# EasyEDA Pro project Violet_Usb_Hub.eprj

# Schematic Schematic1
Board Name: Board1; Create Date: 2026-05-30; Page Name: P1; Project Name: Violet_Usb_Hub; Schematic Name: Schematic1; Update Date: 2026-05-30; Company: EasyEDA.com; Page Size: A4; Version: V1.0
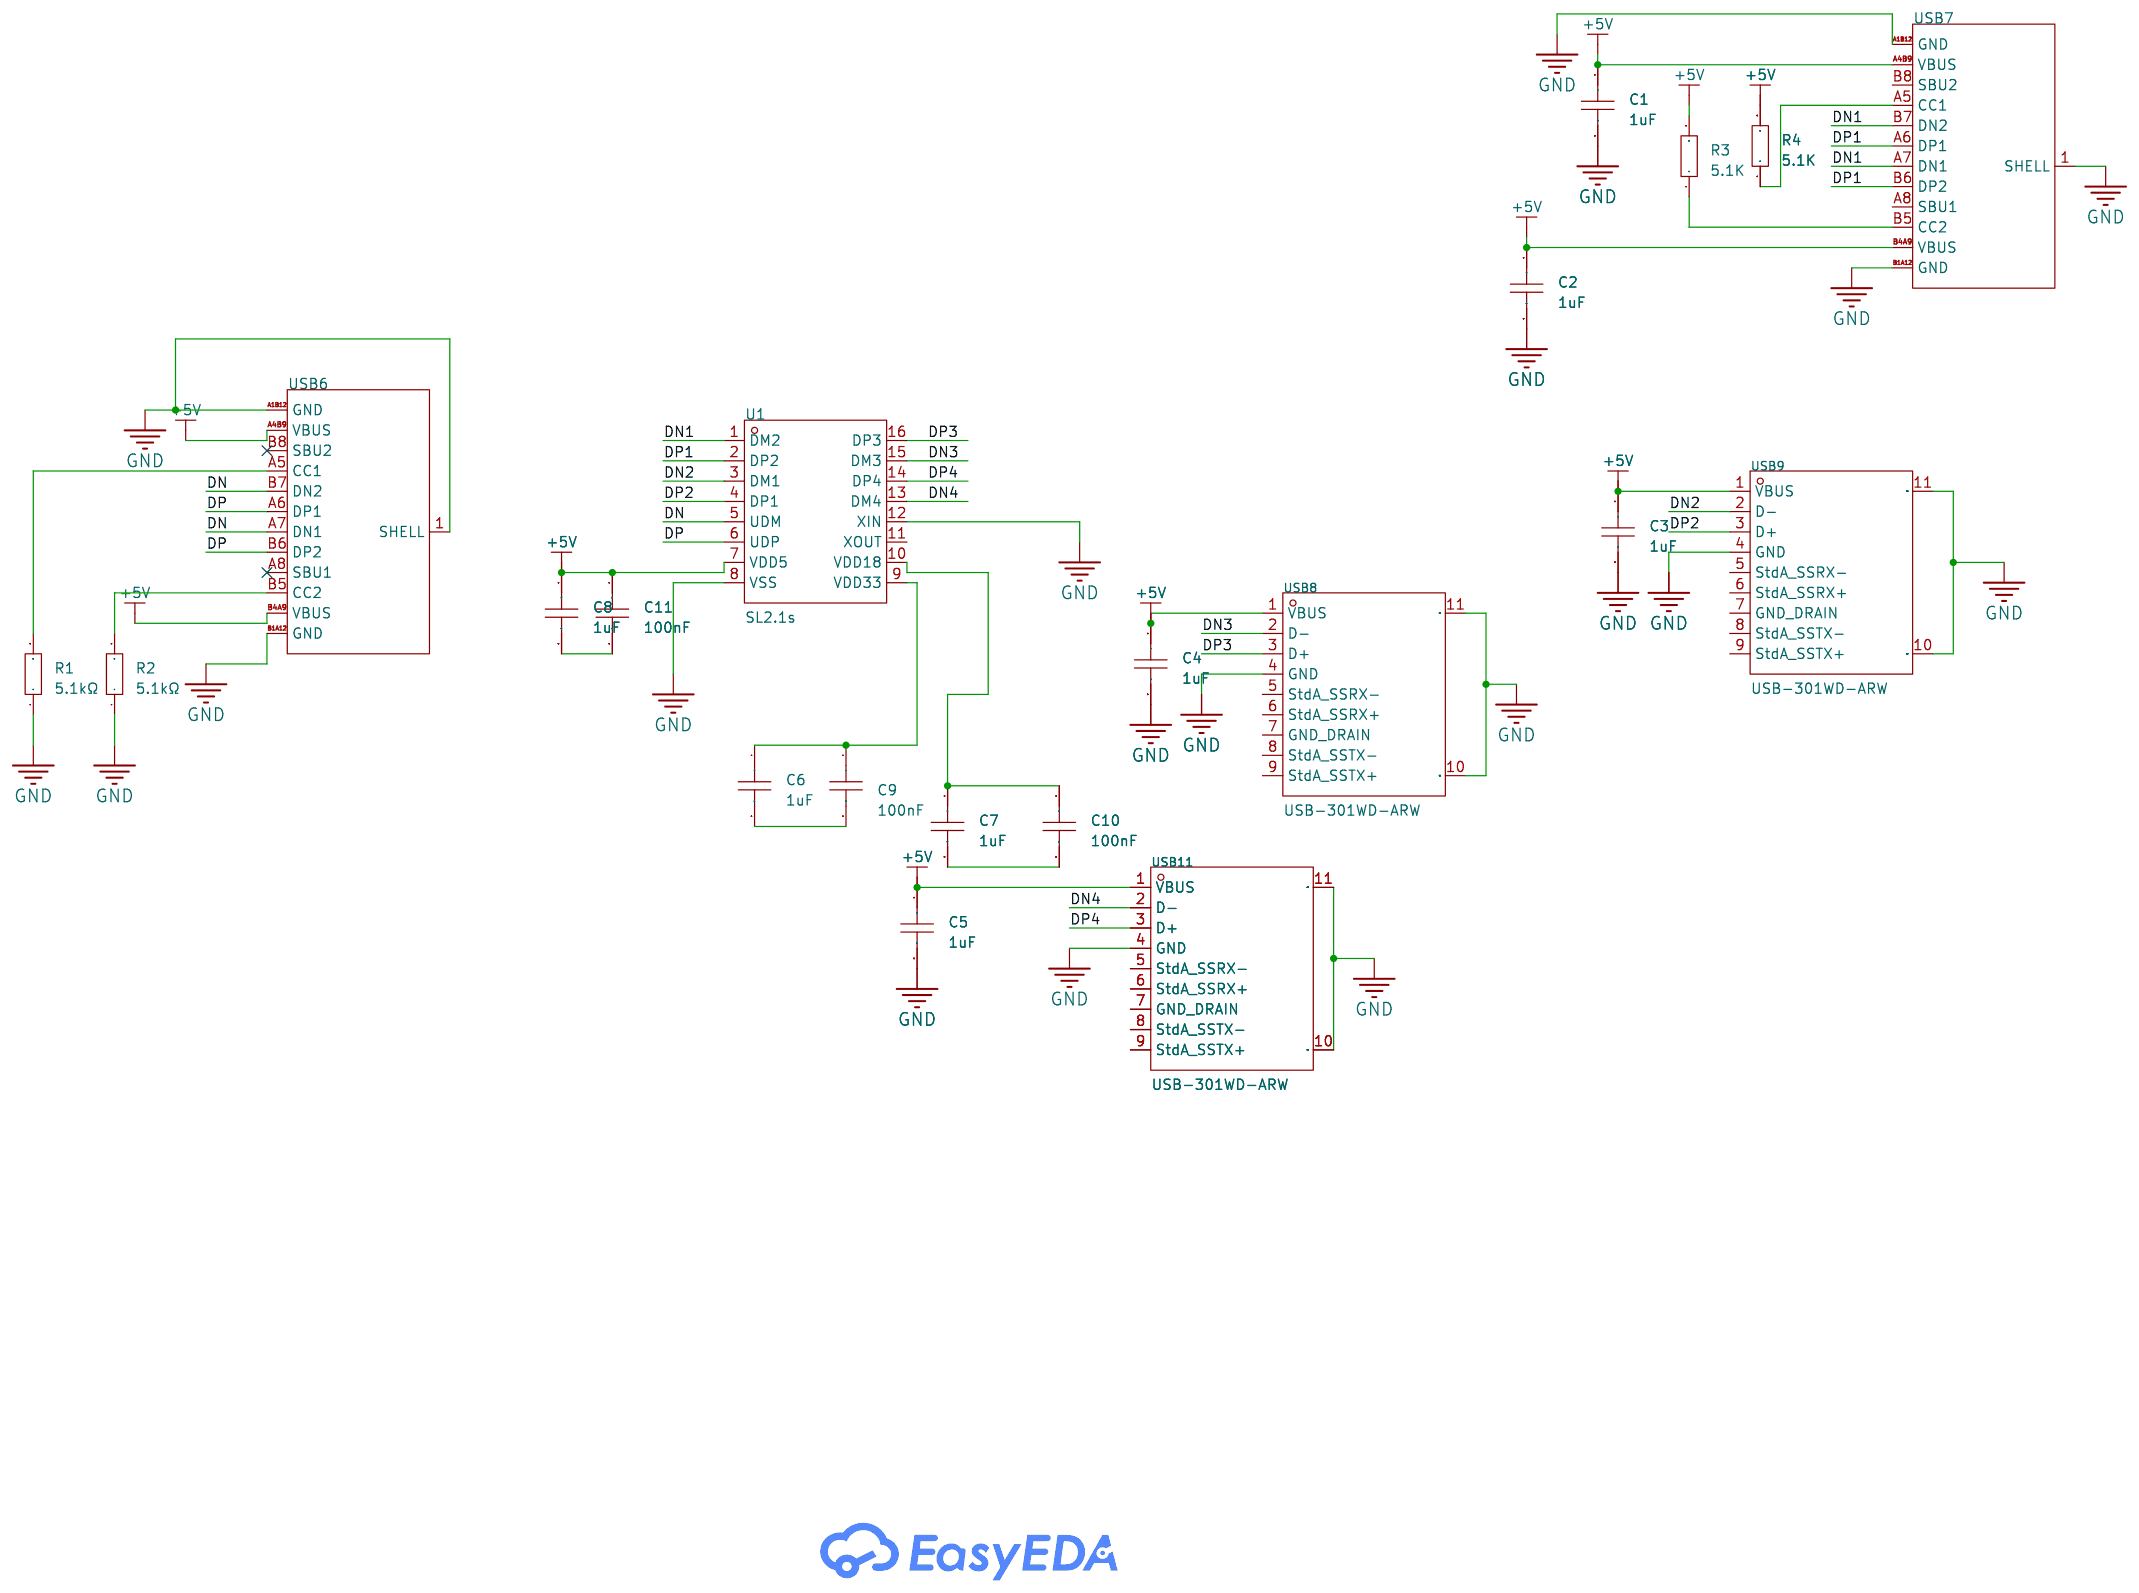
[diagram p0: schematic sheet]

## Parts
C1  1uF  [C0603]
C2  1uF  [C0603]
C3  1uF  [C0603]
C4  1uF  [C0603]
C5  1uF  [C0603]
C6  1uF  [C0603]
C7  1uF  [C0603]
C8  1uF  [C0603]
C9  100nF  [C0603]
C10  100nF  [C0603]
C11  100nF  [C0603]
R1  5.1kΩ  [R0603]
R2  5.1kΩ  [R0603]
R3  5.1K  [R0603]
R4  5.1K  [R0603]
U1  SL2.1s  [SSOP-16_L4.6-W2.6-P0.53-LS4.0-BL]
USB6  JBL-104312272-E  [USB-C-SMD_JBL-104312272-E]
USB7  JBL-104312272-E  [USB-C-SMD_JBL-104312272-E]
USB8  USB-301WD-ARW  [USB-TH_XUNPU_USB-301WD-ARW]
USB9  USB-301WD-ARW  [USB-TH_XUNPU_USB-301WD-ARW]
USB11  USB-301WD-ARW  [USB-TH_XUNPU_USB-301WD-ARW]

## Library data of the parts
C1-C11 = CAP_0603: Supplier Footprint: 0603
R1-R4 = Res_0603: Supplier Footprint: 0603
U1 = SL2.1s: LCSC Part Name: USB2.0 HUB控制器集成电路; Supplier Part: C2684433; Manufacturer: CoreChips(和芯润德); Supplier Footprint: SSOP-16; JLCPCB Part Class: Extended Part; Datasheet: https://item.szlcsc.com/datasheet/SL2.1s/2782346.html; Supplier: LCSC; type: Hub; USB Protocol: USB 2.0; Voltage - Supply: 4V~5.25V; Operating Temperature: 0℃~+70℃; Current - Supply: 120mA; Quiescent Supply Current: 2.5mA; Number of Channels: 4
USB6 USB7 = JBL-104312272-E: LCSC Part Name: Type-C 母 卧贴; Supplier Part: C52711389; Manufacturer: JBL(金比莱); Supplier Footprint: SMD; JLCPCB Part Class: Extended Part; Datasheet: https://item.szlcsc.com/datasheet/JBL-104312272-E/55589489.html; Supplier: LCSC; Connector Type: Type-C; Protocol Standard: USB 3.0; Gender: Female; Mounting Type: Surface Mount, Right Angle; Number of Contacts: 16P; Number of Ports: 1; Current Rating-Power: 5A; Detection color: Black; Operating Temperature: -40℃~+80℃
USB8 USB9 USB11 = USB-301WD-ARW: LCSC Part Name: Type-A 母 弯插; Supplier Part: C2895024; Manufacturer: XUNPU(讯普); Supplier Footprint: 插件; JLCPCB Part Class: Extended Part; Datasheet: https://item.szlcsc.com/datasheet/USB-301WD-ARW/3132961.html; Supplier: LCSC; Connector Type: Type-A; Protocol Standard: USB 3.0; Gender: Female; Mounting Type: Right Angle; Number of Contacts: 9P; Number of Ports: 1; Current Rating-Power: 1.8A; Voltage Rating: 30V; Length: 16.5mm; Detection color: Blue; Operating Temperature: -30℃~+80℃

## Nets
+5V: C1.1 C2.1 C3.1 C4.1 C5.1 C8.1 C11.1 R3.2 R4.2 U1.7(VDD5) USB6.A4B9(VBUS) USB6.B4A9(VBUS) USB7.A4B9(VBUS) USB7.B4A9(VBUS) USB8.1(VBUS) USB9.1(VBUS) USB11.1(VBUS)
GND: C1.2 C2.2 C3.2 C4.2 C5.2 R1.1 R2.1 U1.8(VSS) U1.12(XIN) USB6.1(SHELL) USB6.A1B12(GND) USB6.B1A12(GND) USB7.1(SHELL) USB7.A1B12(GND) USB7.B1A12(GND) USB8.4(GND) USB8.10(SHIELD) USB8.11(SHIELD) USB9.4(GND) USB9.10(SHIELD) USB9.11(SHIELD) USB11.4(GND) USB11.10(SHIELD) USB11.11(SHIELD)
DN: U1.5(UDM) USB6.A7(DN1) USB6.B7(DN2)
DN1: U1.1(DM2) USB7.A7(DN1) USB7.B7(DN2)
DN2: U1.3(DM1) USB9.2(D-)
DN3: U1.15(DM3) USB8.2(D-)
DN4: U1.13(DM4) USB11.2(D-)
DP: U1.6(UDP) USB6.A6(DP1) USB6.B6(DP2)
DP1: U1.2(DP2) USB7.A6(DP1) USB7.B6(DP2)
DP2: U1.4(DP1) USB9.3(D+)
DP3: U1.16(DP3) USB8.3(D+)
DP4: U1.14(DP4) USB11.3(D+)
$1N2416: R1.2 USB6.A5(CC1)
$1N2422: R2.2 USB6.B5(CC2)
$1N4124: R4.1 USB7.A5(CC1)
$1N4130: R3.1 USB7.B5(CC2)
$1N4557: C6.1 C9.1 U1.9(VDD33)
$1N4583: C7.1 C10.1 U1.10(VDD18)
$1N4683: C6.2 C9.2
$1N4735: C8.2 C11.2
$1N4775: C7.2 C10.2

Not connected (* = marked no-connect by the designer): U1 11(XOUT); USB6 A8(SBU1)* B8(SBU2)*; USB7 A8(SBU1) B8(SBU2); USB8 5(StdA_SSRX-) 6(StdA_SSRX+) 7(GND_DRAIN) 8(StdA_SSTX-) 9(StdA_SSTX+); USB9 5(StdA_SSRX-) 6(StdA_SSRX+) 7(GND_DRAIN) 8(StdA_SSTX-) 9(StdA_SSTX+); USB11 5(StdA_SSRX-) 6(StdA_SSRX+) 7(GND_DRAIN) 8(StdA_SSTX-) 9(StdA_SSTX+)

# Board PCB1
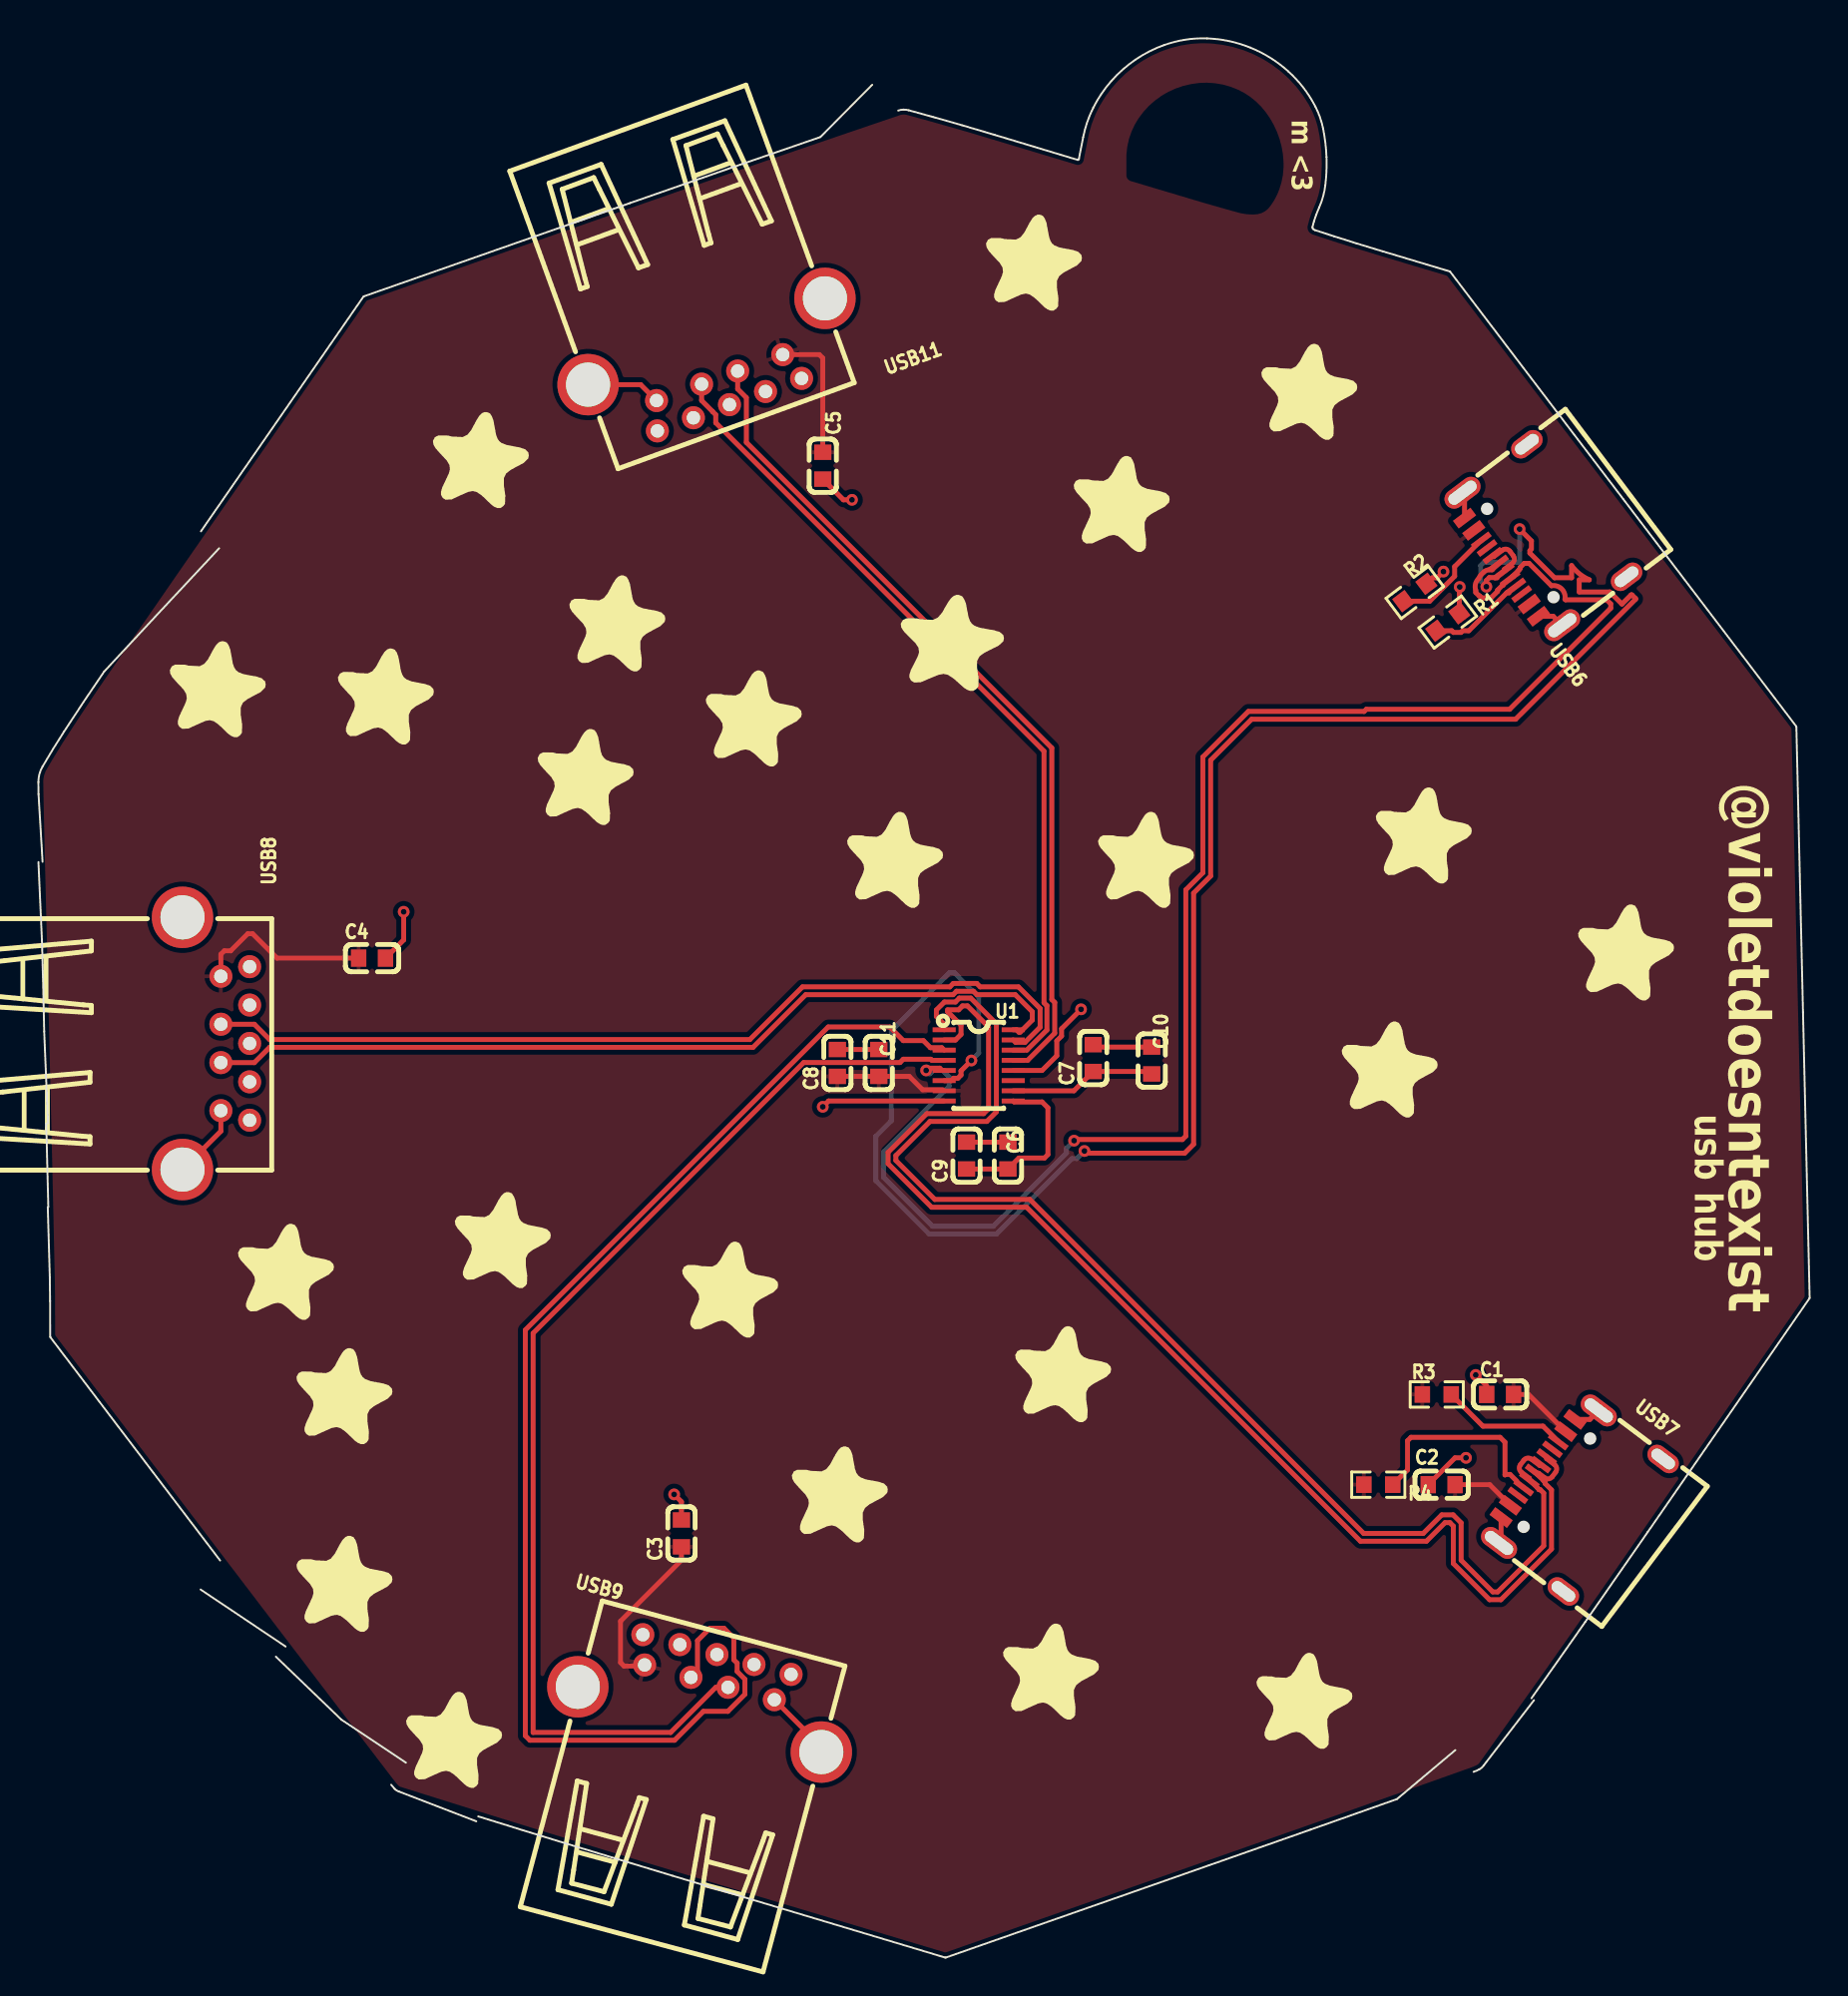
[diagram p1: board, top side]
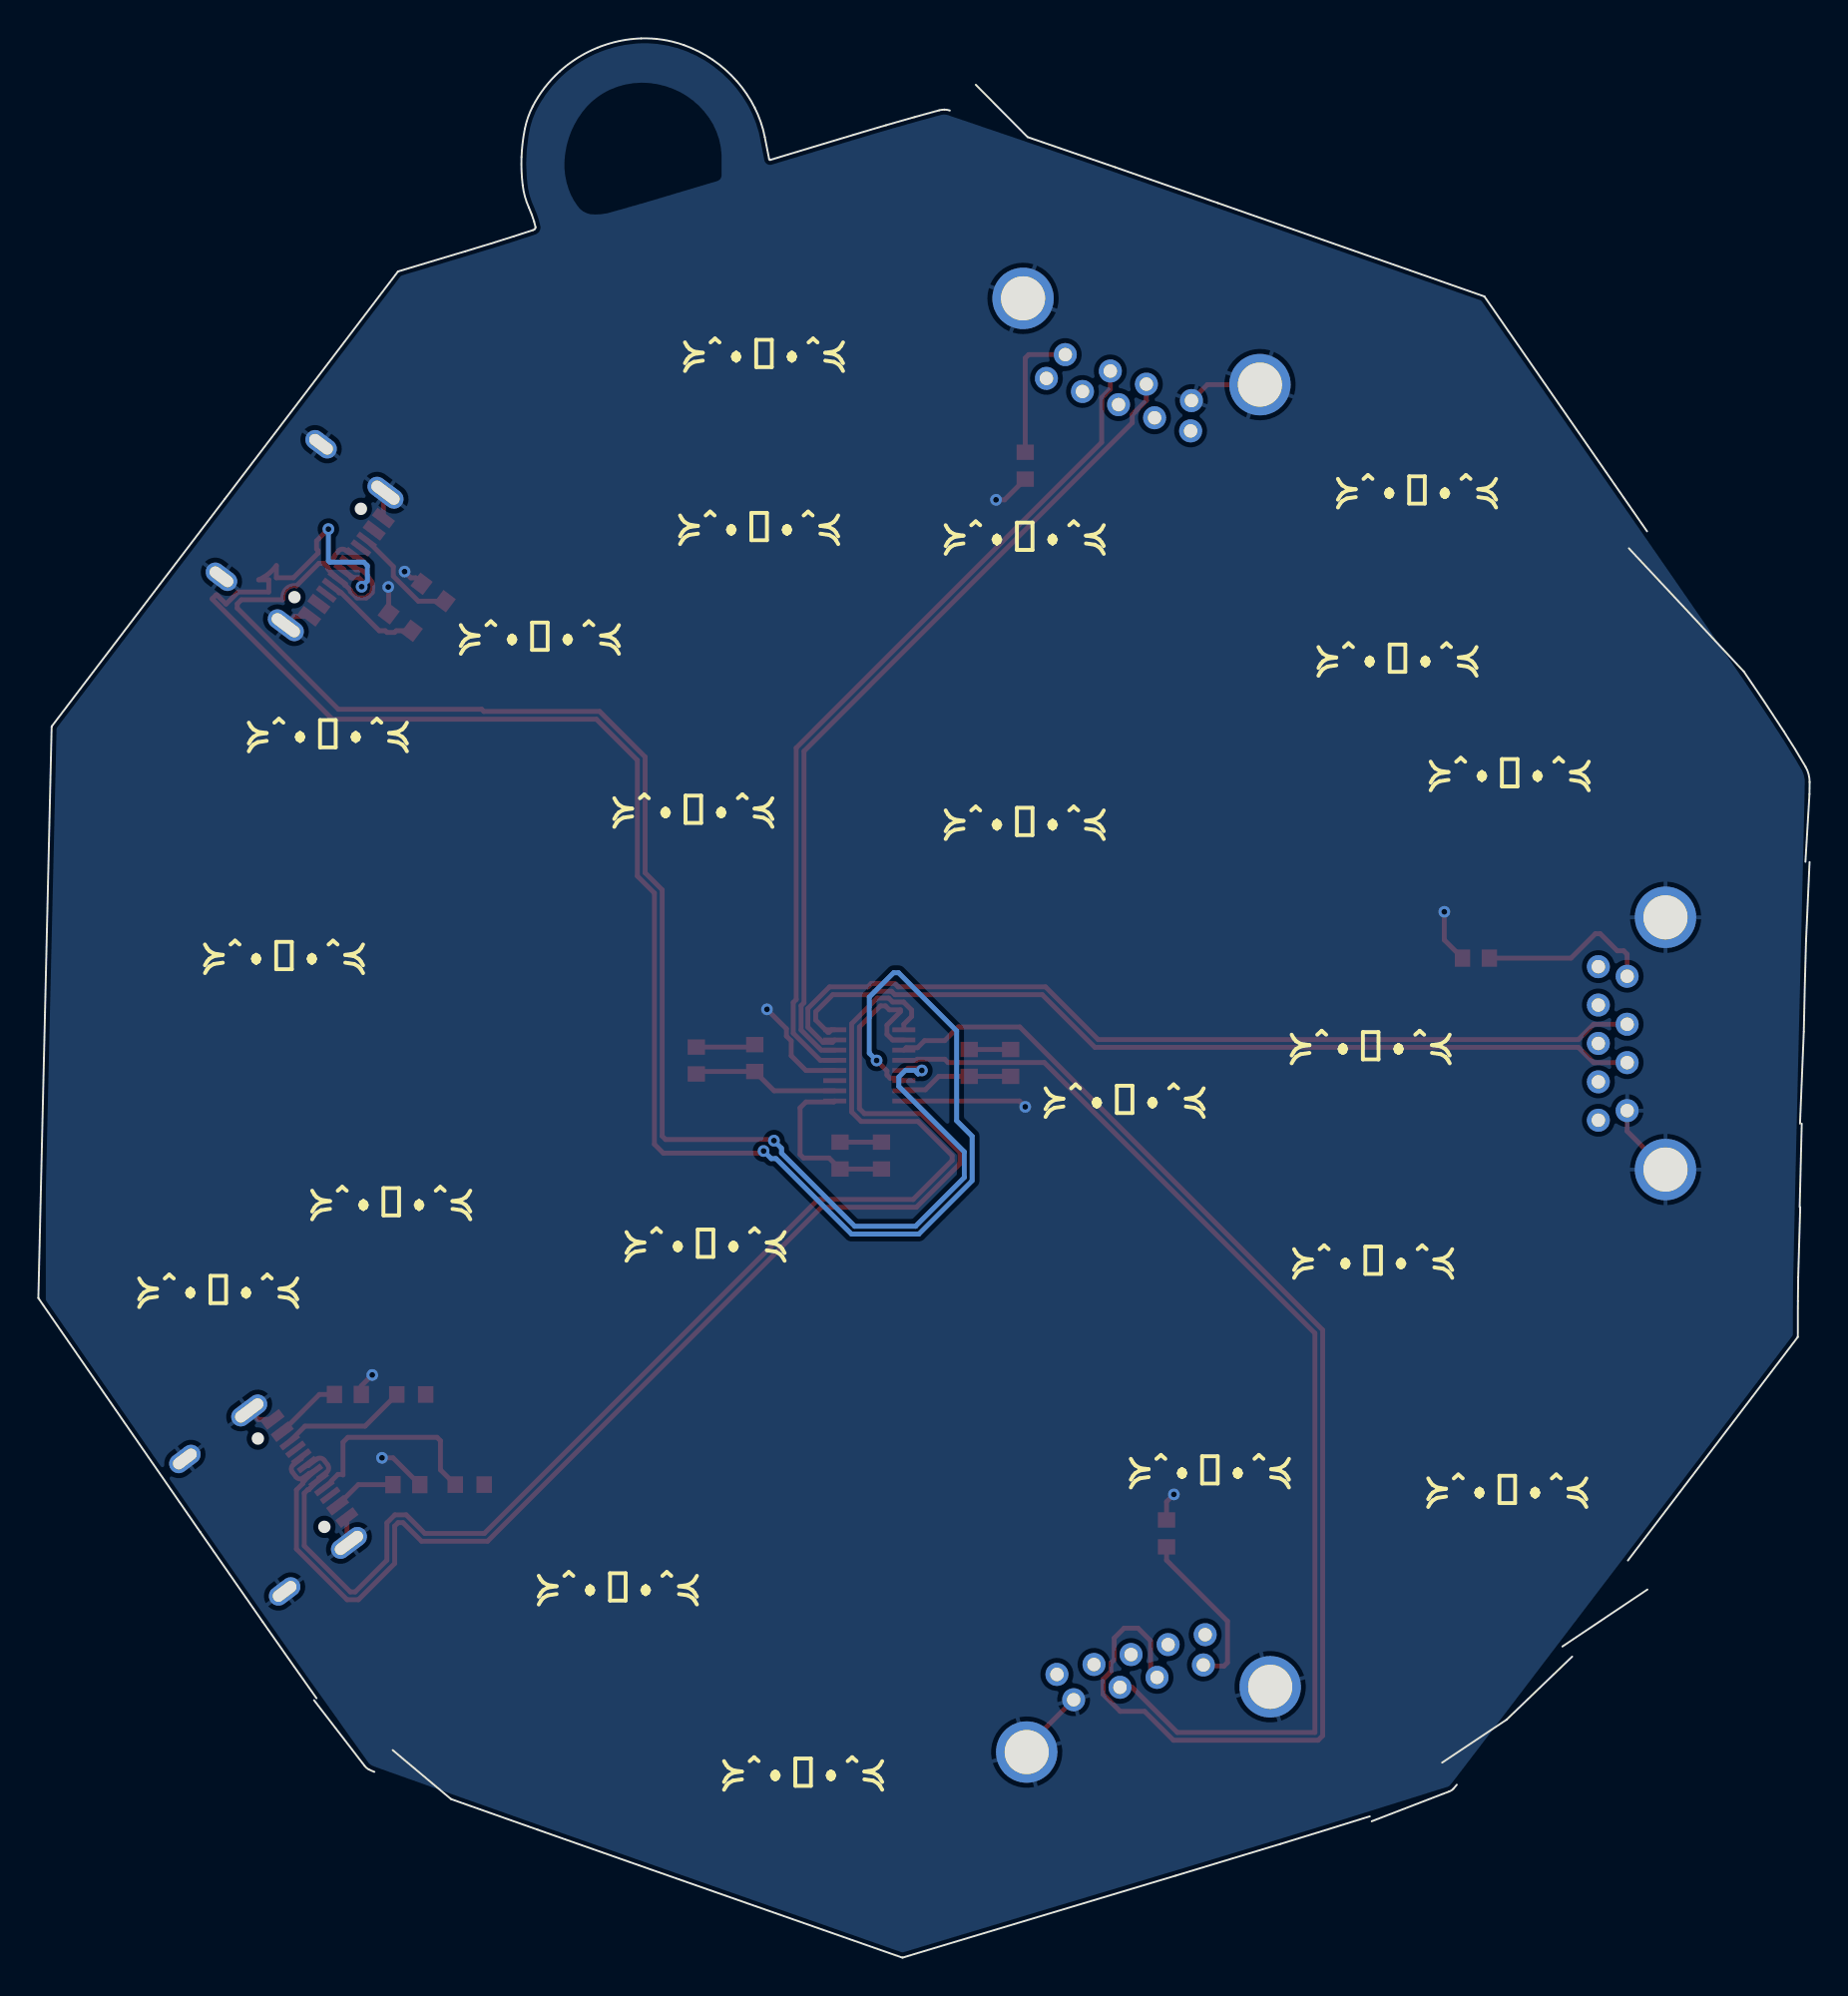
[diagram p2: board, bottom side, seen from below]

Outline 92.33 x 99.99 mm; copper layers: Top Layer, Bottom Layer. Coordinates in mm from the lower left corner of the outline.
Outline path: 0,61.24 arc(0.06,61.66) 0.22,62.06 arc(0.77,62.97) 1.34,63.88 arc(2.37,65.45) 3.43,67 arc(5.95,70.66) 8.48,74.31 16.94,86.53 arc(16.95,86.54) 16.97,86.55 30.84,91.41 arc(33.52,92.35) 36.19,93.28 arc(38.48,94.07) 40.76,94.85 arc(42.79,95.54) 44.82,96.23 arc(44.96,96.27) 45.1,96.28 arc(45.24,96.27) 45.37,96.24 arc(46.01,96.07) 46.65,95.89 arc(47.4,95.68) 48.14,95.47 arc(49,95.22) 49.85,94.96 54.17,93.66 arc(54.21,93.67) 54.23,93.7 54.46,94.85 arc(54.67,95.63) 54.99,96.38 arc(55.41,97.1) 55.92,97.77 arc(56.52,98.36) 57.18,98.88 arc(57.9,99.31) 58.67,99.64 arc(59.77,99.92) 60.91,99.99 arc(62.06,99.85) 63.17,99.51 arc(64.22,98.98) 65.15,98.27 arc(65.94,97.42) 66.56,96.44 arc(66.8,95.88) 66.97,95.28 arc(67.08,94.55) 67.14,93.81 arc(67.14,93.07) 67.08,92.34 arc(66.96,91.75) 66.76,91.19 arc(66.68,90.99) 66.6,90.79 arc(66.54,90.62) 66.48,90.44 arc(66.44,90.3) 66.41,90.16 arc(66.41,90.11) 66.44,90.07 arc(66.49,90.03) 66.54,90 arc(67.05,89.84) 67.55,89.67 arc(68.13,89.49) 68.71,89.31 arc(69.39,89.1) 70.07,88.9 73.56,87.85 arc(73.58,87.84) 73.59,87.83 82.61,75.99 91.62,64.15 arc(91.63,64.14) 91.63,64.12 91.98,49.25 92.33,34.38 arc(92.32,34.36) 92.32,34.35 83.89,22.17 arc(82.26,19.83) 80.63,17.49 arc(79.23,15.5) 77.83,13.51 arc(76.58,11.76) 75.33,10 arc(75.23,9.89) 75.1,9.8 arc(74.96,9.74) 74.81,9.68 arc(72.81,8.97) 70.82,8.26 arc(68.56,7.46) 66.3,6.67 arc(63.66,5.74) 61.01,4.81 47.3,0 arc(47.28,0) 47.27,0 33.05,4.27 arc(30.31,5.09) 27.58,5.92 arc(25.25,6.64) 22.93,7.36 arc(20.86,8) 18.8,8.65 arc(18.68,8.71) 18.57,8.79 arc(18.48,8.9) 18.39,9.01 arc(17.09,10.7) 15.8,12.39 arc(14.34,14.3) 12.89,16.21 arc(11.18,18.45) 9.47,20.69 0.63,32.32 arc(0.62,32.33) 0.62,32.35 0.61,34.21 arc(0.61,34.83) 0.6,35.46 arc(0.56,37.28) 0.52,39.1 arc(0.47,41.28) 0.42,43.45 arc(0.36,45.85) 0.3,48.25 arc(0.25,50.61) 0.19,52.97 arc(0.14,55.02) 0.09,57.08 arc(0.05,58.85) 0.01,60.62 arc(0,60.93) 0,61.24
Stack: Top Layer 0.035mm / Dielectric1 1.51mm FR4 er 4.5 / Bottom Layer 0.035mm

## Design rules (mm)
net DN1: DP3
net DP1: DP3
net DN2: DP1
net DP2: DP1
net DN: DP4
net DP: DP4
net DN4: DP5
net DP4: DP5
net DN3: DP2
net DP3: DP2
template: Custom Config
spacing copperThickness1oz (default): track to track 0.102, other pairs 0.152 to 0.3
spacing copperThickness2oz: track to track 0.203, other pairs 0.152 to 0.3
track width copperThickness1oz (default): min 0.127, default 0.254, max 2.54
track width copperThickness2oz: min 0.203, default 0.254, max 2.54
differential pair differentialPair (default): width min 0.127, default 0.254, max 2.54; gap min 0.152, default 0.152
via viaSize (default): diameter min 0.5, default 0.61, max 10; hole min 0.3, default 0.305, max 6.3

## Placement (name value [footprint] x y rotation side)
C1  1uF  [C0603]  76.19 29.34 180 top
C2  1uF  [C0603]  73.14 24.64 180 top
C3  1uF  [C0603]  33.52 22.1 90 top
C4  1uF  [C0603]  17.39 52.07 0 top
C5  1uF  [C0603]  40.89 77.73 270 top
C6  1uF  [C0603]  50.54 41.79 90 top
C7  1uF  [C0603]  54.98 46.87 90 top
C8  1uF  [C0603]  41.65 46.61 90 top
C9  100nF  [C0603]  48.38 41.79 90 top
C10  100nF  [C0603]  58.03 46.74 90 top
C11  100nF  [C0603]  43.81 46.61 90 top
R1  5.1kΩ  [R0603]  73.46 69.58 217 top
R2  5.1kΩ  [R0603]  71.75 71.12 217 top
R3  5.1K  [R0603]  72.89 29.34 180 top
R4  5.1K  [R0603]  69.84 24.64 180 top
U1  SL2.1s  [SSOP-16_L4.6-W2.6-P0.53-LS4.0-BL]  49.01 46.49 270 top
USB6  JBL-104312272-E  [USB-C-SMD_JBL-104312272-E]  78.22 73.92 127 top
USB7  JBL-104312272-E  [USB-C-SMD_JBL-104312272-E]  80.13 24.01 53 top
USB8  USB-301WD-ARW  [USB-TH_XUNPU_USB-301WD-ARW]  9.26 47.63 270 top
USB9  USB-301WD-ARW  [USB-TH_XUNPU_USB-301WD-ARW]  34.92 14.1 345 top
USB11  USB-301WD-ARW  [USB-TH_XUNPU_USB-301WD-ARW]  35.42 82.55 200 top

## Footprints (pads in the part's own frame, mm; a bottom-side part is the same pattern mirrored in y, then rotated)
C0603
  rect 0.8x0.9 smd: 1(-0.7,0) 2(0.7,0)
R0603
  rect 0.806x0.864 smd: 1(-0.753,0) 2(0.753,0)
SSOP-16_L4.6-W2.6-P0.53-LS4.0-BL
  rect 0.25x1.2 smd: 1(-1.855,-1.8) 2(-1.325,-1.8) 3(-0.795,-1.8) 4(-0.265,-1.8) 5(0.265,-1.8) 6(0.795,-1.8) 7(1.325,-1.8) 8(1.855,-1.8) 9(1.855,1.8) 10(1.325,1.8) 11(0.795,1.8) 12(0.265,1.8) 13(-0.265,1.8) 14(-0.795,1.8) 15(-1.325,1.8) 16(-1.855,1.8)
USB-C-SMD_JBL-104312272-E
  oval 1x2.1 hole 0.6x1.7: 1(-4.32,1.745) 1(4.32,1.745)
  oval 1x1.8 hole 0.6x1.4: 1(-4.32,-2.455) 1(4.32,-2.455)
  rect 0.5x1.14 smd: A1B12(-3.2,2.455) A4B9(-2.4,2.455) B1A12(3.2,2.455) B4A9(2.4,2.455)
  rect 0.3x1.14 smd: A5(-1.25,2.455) A6(-0.25,2.455) A7(0.25,2.455) A8(1.25,2.455) B5(1.75,2.455) B6(0.75,2.455) B7(-0.75,2.455) B8(-1.75,2.455)
USB-TH_XUNPU_USB-301WD-ARW
  round 1.2 hole 0.7: 1(-3.5,0.25) 2(-1,0.25) 3(1,0.25) 4(3.5,0.25) 5(4,1.75) 6(2,1.75) 7(0,1.75) 8(-2,1.75) 9(-4,1.75)
  round 3.2 hole 2.3: 10(-6.57,-1.75) 11(6.57,-1.75)

## Nets
As in the schematic.

Pads without a net: U1 11; USB6 A8 B8; USB7 A8 B8; USB8 5 6 7 8 9; USB9 5 6 7 8 9; USB11 5 6 7 8 9

## Via types
v1: diameter 0.61, hole 0.305, Top Layer to Bottom Layer, 15 vias

## Routing (per net, layer and track width the routed paths; a pad name or vN(x,y) marks a point on that pad's centre or on a via; arc(x,y) is an arc through that point)
+5V: length 37.7
  Top Layer w0.254: USB9.1 31.55,15.19 30.53,15.19 30.35,15.37 30.35,17.53 33.52,20.71 33.52,21.4 ; C8.1 C11.1 45.4,45.92 46.1,45.22 47.15,45.22 ; C1.1 77.68,29.34 USB7.B4A9 ; USB8.1 9.52,52.28 9.7,52.46 10.03,52.46 10.92,53.35 11.17,53.35 12.44,52.08 C4.1 ; C5.1 40.89,83.34 40.71,83.52 USB11.1 ; USB7.A4B9 75.65,24.64 C2.1
GND: length 41.7
  Top Layer w0.254: USB8.4 9.52,43.06 USB8.11 ; USB7.A1B12 76.25,21.72 USB7.1 ; C1.2 75.5,29.79 v1(74.93,30.36) ; v1(19.05,54.49) 19.05,53.02 C4.2 ; v1(54.35,49.41) 53.34,48.39 53.34,48.02 53.09,47.77 53.09,46.99 52.32,46.22 U1.12 ; v1(40.89,44.33) 41.19,44.63 U1.8 ; R1.1 74.07,71.39 v1(74.09,71.41) ; v1(73.24,72.21) 72.92,71.89 72.66,71.89 72.35,71.58 ; C5.2 41.97,75.95 v1(42.41,75.95) ; USB7.1 80.87,28.04 USB7.B1A12 ; C3.2 33.52,23.76 v1(33.14,24.14) ; USB11.11 31.4,81.95 32.23,81.12 ; USB6.A1B12 78.96,69.89 USB6.1 ; USB6.1 74.34,76.22 USB6.B1A12 ; v1(74.42,26.04) 73.85,26.04 C2.2 ; USB9.11 40.81,10.99 USB9.4
DN: length 83.4
  Top Layer w0.254: 76.9,71.95 76.83,71.95 77.13,72.24 arc(77.17,72.29) 77.21,72.34 77.22,72.35 77.22,72.37 arc(77.23,72.4) 77.24,72.43 77.45,72.64 77.71,72.64 78.87,71.48 arc(79.41,71.31) 79.58,70.78 79.61,70.75 81.75,70.75 81.96,70.53 81.96,70.31 76.69,65.04 69.22,65.04 69.11,64.93 63.07,64.93 60.7,62.56 60.7,56.52 59.81,55.63 59.81,42.81 59.63,42.63 54.05,42.63 ; 76.36,71.5 76.32,71.5 76.06,71.25 76.06,71.18 75.72,70.84 75.24,70.84 75.13,70.95 75.11,70.95 74.93,71.13 74.93,71.24 arc(74.91,71.57) 75.09,71.86 arc(75.13,71.95) 75.19,72.03 75.35,72.19 arc(75.48,72.28) 75.64,72.31 75.78,72.31 USB6.A7 ; U1.5 47.11,46.22 46.99,46.34 46.4,46.34 v1(46.28,46.23)
  Bottom Layer w0.254: v1(46.28,46.23) 46.46,46.05 46.48,46.05 46.65,46.23 47.14,46.23 47.48,45.88 47.48,45.4 44.07,41.98 44.07,40.65 46.61,38.11 49.78,38.11 53.59,41.92 53.59,42.17 v1(53.99,42.57)
DN1: length 68.4
  Top Layer w0.254: 47.22,48.35 47.22,48.63 46.81,49.04 46.81,49.37 47.23,49.79 47.8,49.79 48.01,50 48.6,50 49.94,48.66 49.94,44.07 49.44,43.57 46.48,43.57 44.7,41.79 44.7,41.54 46.73,39.5 51.69,39.5 69.08,22.1 72.19,22.1 73.16,23.07 73.75,23.07 74.16,22.65 74.16,20.71 75.82,19.06 76.07,19.06 78.47,21.46 78.47,24.2 78.29,24.38 78.23,24.38 78.21,24.4 arc(78.18,24.45) 78.13,24.49 USB7.B7 77.72,24.98 77.31,25.29 arc(77.2,25.47) 77.25,25.68 77.43,25.92 arc(77.62,26.03) 77.83,25.97 78.27,25.64 USB7.A7
DN2: length 71
  Top Layer w0.254: USB9.2 34.02,14.24 34.18,14.24 34.36,14.42 34.36,16.52 35.01,17.17 35.74,17.17 36.25,16.65 36.25,15.52 36.43,15.35 36.43,14.91 36.83,14.51 36.83,13.72 35.94,12.83 34.67,12.83 33.16,11.33 25.62,11.33 25.39,11.57 25.39,32.7 41.17,48.49 44.38,48.49 45.09,47.78 46.13,47.78 46.5,47.41 47.09,47.41 U1.3
DN3: length 47.5
  Top Layer w0.254: USB8.2 11.26,48.63 12.06,47.83 37.09,47.83 39.83,50.58 47.51,50.58 47.69,50.76 48.92,50.76 49.1,50.58 51.09,50.58 52.22,49.45 52.22,48.48 51.43,47.69 50.94,47.69 U1.15
DN4: length 44.1
  Top Layer w0.254: USB11.2 36.45,81.73 36.9,81.27 36.9,78.94 52.82,63.02 52.82,49.92 52.98,49.76 52.98,48.16 51.57,46.75 U1.13
DP: length 104.7
  Top Layer w0.254: v1(75.48,71.43) 75.48,71.75 75.64,71.9 75.93,71.9 75.94,71.89 76.04,71.89 ; 77.83,73.39 77.83,73.81 v1(77.21,74.43) ; 76.42,72.24 76.42,72.33 76.83,72.64 arc(76.94,72.83) 76.88,73.03 76.7,73.27 arc(76.52,73.38) 76.31,73.33 75.87,72.99 USB6.B6 ; U1.6 47.59,45.69 47.71,45.82 47.93,45.82 48.1,45.98 48.1,46.2 v1(48.64,46.74) ; v1(54.53,42.03) 54.64,41.92 59.75,41.92 60.22,42.38 60.22,55.46 61.11,56.35 61.11,62.39 63.24,64.52 77,64.52 83.26,70.78 83.26,70.81 83.07,71 83.02,71 82.55,70.52 81.92,71.15 80.32,71.15 80.32,71.79 80.84,71.79 arc(80.33,72.1) 79.92,72.53 79.92,71.89 79.03,71.89 77.75,73.18 77.75,73.3 arc(77.78,73.34) 77.8,73.37
  Bottom Layer w0.254: v1(77.21,74.43) 77.21,72.78 77.14,72.7 75.36,72.7 75.18,72.52 75.18,71.73 v1(75.48,71.43) ; v1(48.64,46.74) 49.02,47.12 49.02,50.04 47.75,51.31 47.49,51.31 44.47,48.29 44.47,43.6 43.66,42.8 43.66,40.48 46.44,37.7 49.95,37.7 53.88,41.63 54.13,41.63 v1(54.53,42.03)
DP1: length 70
  Top Layer w0.254: USB7.B6 78.62,25.99 79.03,25.68 arc(79.14,25.5) 79.09,25.29 78.91,25.05 arc(78.72,24.94) 78.52,25 78.21,25.23 arc(78.12,25.26) 78.03,25.3 USB7.A6 78.43,24.88 arc(78.47,24.84) 78.51,24.79 78.52,24.78 78.52,24.76 arc(78.53,24.73) 78.54,24.7 78.87,24.37 78.87,21.29 76.23,18.65 75.64,18.65 73.75,20.54 73.75,22.48 73.57,22.66 73.32,22.66 72.35,21.69 68.91,21.69 51.51,39.09 46.56,39.09 44.29,41.36 44.29,41.95 46.31,43.97 49.27,43.97 49.53,44.23 49.53,48.49 48.43,49.59 48.17,49.59 47.97,49.38 47.39,49.38 47.39,49.28 48.09,48.58 48.09,48.1 47.8,47.81 U1.2
DP2: length 59.3
  Top Layer w0.254: U1.4 46.58,46.75 46.52,46.81 45.09,46.81 44.91,46.64 39.9,46.64 25.79,32.53 25.79,11.74 32.96,11.74 35.31,14.09 USB9.3
DP3: length 46
  Top Layer w0.254: U1.16 50.99,48.34 51.11,48.22 51.18,48.22 51.81,48.85 51.81,49.28 50.92,50.17 48.93,50.17 48.75,50.35 47.86,50.35 47.68,50.17 40,50.17 37.26,47.43 12.06,47.43 11.26,46.63 USB8.3
DP4: length 43.3
  Top Layer w0.254: 34.57,81.98 34.57,81.12 35.14,80.55 35.14,80.54 35.31,80.38 35.31,79.96 52.42,62.85 52.42,49.75 52.57,49.6 52.57,48.33 51.52,47.28 U1.14
$1N2416: length 4.9
  Top Layer w0.254: 76.66,71.1 76.53,71.1 74.56,69.13 74.24,69.13 74.16,69.05 73.77,69.05 73.68,69.13 R1.2 72.74,69.01
$1N2422: length 5.7
  Top Layer w0.254: R2.2 72.53,70.67 73.83,71.97 73.83,72.47 75.21,73.85
$1N4124: length 10.3
  Top Layer w0.254: 77.06,24.83 76.71,25.18 76.47,25.18 76.45,25.15 76.45,26.85 76.19,27.11 71.55,27.11 71.37,26.93 71.37,25.41 R4.1
$1N4130: length 6.6
  Top Layer w0.254: R3.1 75.29,27.69 78.43,27.69 79.23,26.89
$1N4557: length 8.9
  Top Layer w0.254: U1.9 50.86,44.58 52.32,44.58 52.62,44.27 52.62,41.84 52.44,41.66 51.11,41.66 C6.1 C9.1
$1N4583: length 7.7
  Top Layer w0.254: C10.1 57.91,46.17 C7.1 53.98,45.16 U1.10
$1N4683: length 2.2
  Top Layer w0.254: C6.2 C9.2
$1N4735: length 2.2
  Top Layer w0.254: C8.2 C11.2
$1N4775: length 3.1
  Top Layer w0.254: C7.2 55.11,47.44 C10.2

## Copper pours and planes (outline as drawn; the poured copper is in the pictures)
+5V on Top Layer: -23.76,105.03 95.88,105.03 95.88,-16.63 -23.76,-16.63
GND on Bottom Layer: -28.96,102.75 91.94,102.75 91.94,-23.62 -28.96,-23.62

## Text on the board
Bottom Silkscreen Layer: ≽^•⩊•^≼
Top Silkscreen Layer: m <3 | usb hub | @violetdoesntexist
